# Altium project MB1292.PrjPcb (part 2 of 3)

## Sheet MEMS.SchDoc: MEMS sensors and Quad-SPI
size A4; Date: Not used; ApprovedBy: Not used; CheckedBy: Not used; Author: Not used; CompanyName: STMicroelectronics; DrawnBy: Not used; Engineer: Not used; Organization: Not used; Address1: Not used; Address2: Not used; Address3: Not used; Address4: Not used; DocumentNumber: Not used; Revision: Not used; SheetNumber: 4; SheetTotal: 8; CurrentTime: Not used; CurrentDate: Not used; Time: Not used; DocumentFullPathAndName: Not used; DocumentName: Not used; ModifiedDate: Not used; ImagePath: Not used; ProjectName: Not used; Application_BuildNumber: Not used
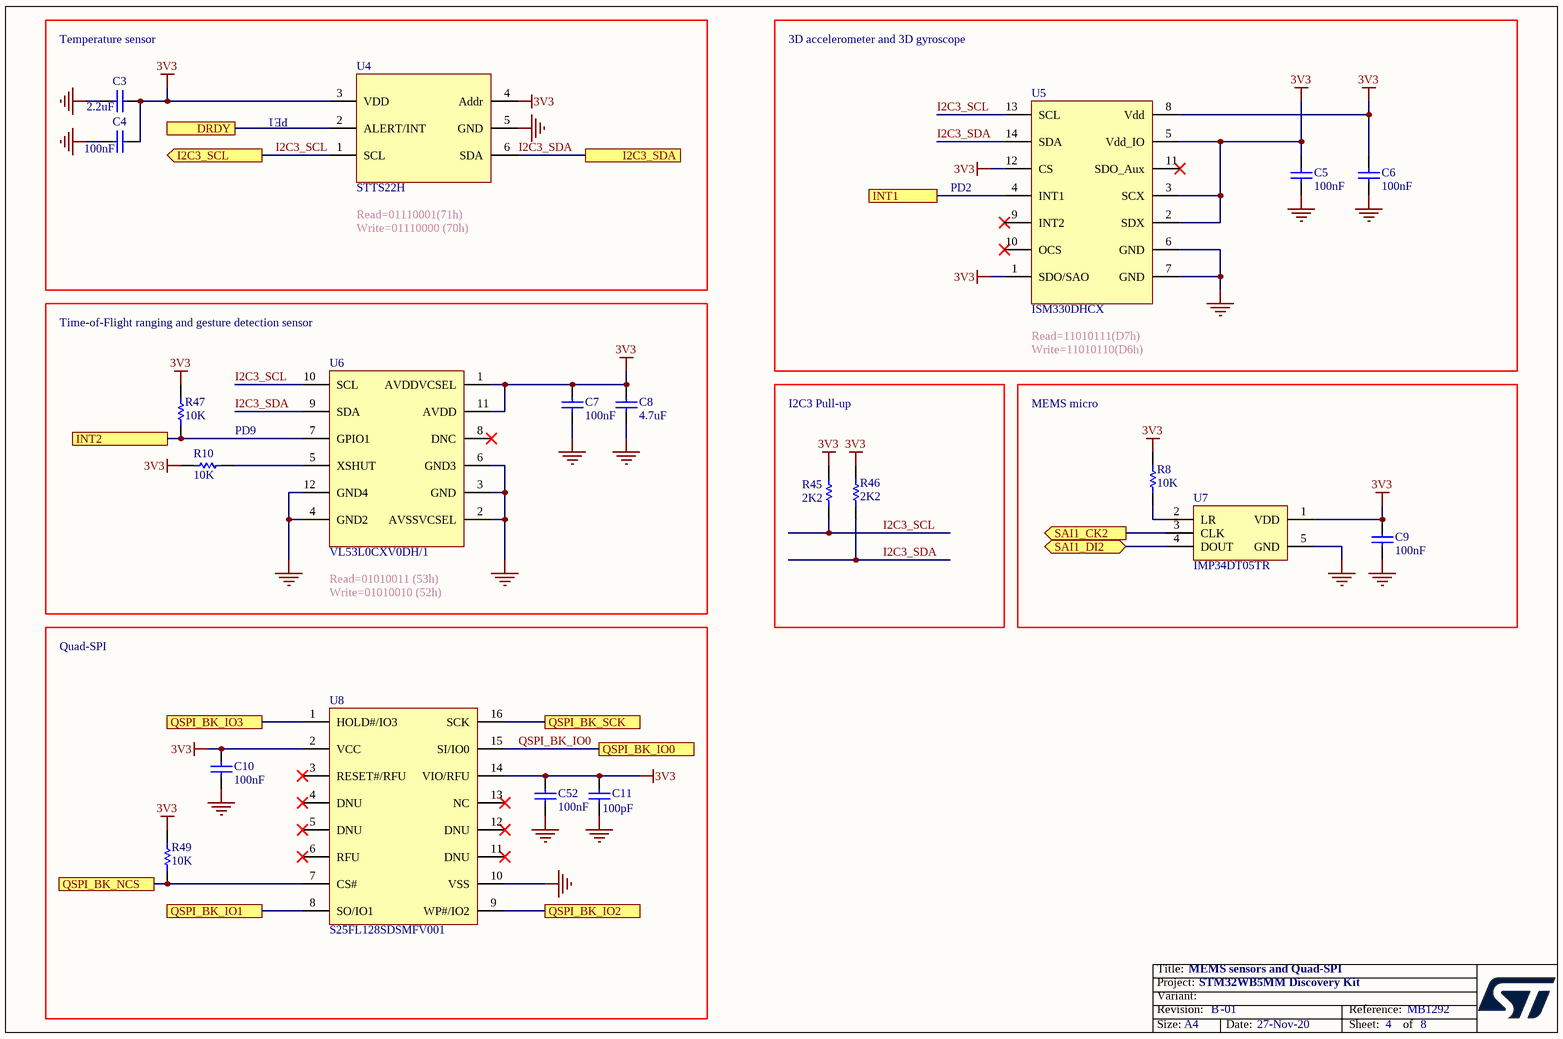
[diagram p4: MEMS.SchDoc]

### Parts
C3  value 2.2uF  [C0603_H0P8]  (hidden comment: Capacitor)
C4  value 100nF  [C0402]  (hidden comment: Capacitor)
C5  value 100nF  [C0402]  (hidden comment: Capacitor)
C6  value 100nF  [C0402]  (hidden comment: Capacitor)
C7  value 100nF  [C0402]  (hidden comment: Capacitor)
C8  value 4.7uF  [C0603]  (hidden comment: Capacitor)
C9  value 100nF  [C0402]  (hidden comment: Capacitor)
C10  value 100nF  [C0402]  (hidden comment: Capacitor)
C11  value 100pF  [C0603_H0P8]  (hidden comment: Capacitor)
C52  value 100nF  [C0402]  (hidden comment: Capacitor)
R8  value 10K  [R0402]  (hidden comment: Resistor)
R10  value 10K  [R0402]  (hidden comment: Resistor)
R45  value 2K2  [R0603]  (hidden comment: Resistor)
R46  value 2K2  [R0603]  (hidden comment: Resistor)
R47  value 10K  [R0402]  (hidden comment: Resistor)
R49  value 10K  [R0402]  (hidden comment: Resistor)
U4  STTS22H  [ICC_UDFN6-EPAD_2X2_P065]
U5  ISM330DHCX  [ICC_LGA14_3X2P5_P050]
U6  VL53L0CXV0DH/1  [OPT_TOF_ST_VL53L0X_LGA12_4P4X2P4_P080]
U7  IMP34DT05TR  [MIC_HCLGA_3X4X1_4LD]
U8  S25FL128SDSMFV001  [ICC_SOIC16_10P30X7P50_P127_H2P65]

### Blocks framed on the sheet
I2C3 Pull-up: R45 R46
MEMS micro: C9 R8 U7
Quad-SPI: C10 C11 C52 R49 U8

### Ports
DRDY, I2C3_SCL (out), I2C3_SDA, INT1, INT2, QSPI_BK_IO0, QSPI_BK_IO1, QSPI_BK_IO2, QSPI_BK_IO3, QSPI_BK_NCS, QSPI_BK_SCK, SAI1_CK2 (out), SAI1_DI2 (bidir)

### Nets
3V3: C3.2 C4.2 C5.2 C6.2 C7.2 C8.2 C9.2 C10.2 C11.2 C52.2 R8.2 R10.1 R45.2 R46.2 R47.2 R49.2 U4.3(VDD) U4.4(Addr) U5.1(SDO/SAO) U5.2(SDX) U5.3(SCX) U5.5(Vdd_IO) U5.8(Vdd) U5.12(CS) U6.1(AVDDVCSEL) U6.11(AVDD) U7.1(VDD) U8.2(VCC) U8.14(VIO/RFU)
GND: C3.1 C4.1 C5.1 C6.1 C7.1 C8.1 C9.1 C10.1 C11.1 C52.1 U4.5(GND) U5.6(GND) U5.7(GND) U6.2(AVSSVCSEL) U6.3(GND) U6.4(GND2) U6.6(GND3) U6.12(GND4) U7.5(GND) U8.10(VSS)
DRDY: U4.2(ALERT/INT) ; port DRDY
I2C3_SCL: R45.1 U4.1(SCL) U5.13(SCL) U6.10(SCL) ; port I2C3_SCL
I2C3_SDA: R46.1 U4.6(SDA) U5.14(SDA) U6.9(SDA) ; port I2C3_SDA
INT1: U5.4(INT1) ; port INT1
INT2: R47.1 U6.7(GPIO1) ; port INT2
QSPI_BK_IO0: U8.15(SI/IO0) ; port QSPI_BK_IO0
QSPI_BK_IO1: U8.8(SO/IO1) ; port QSPI_BK_IO1
QSPI_BK_IO2: U8.9(WP#/IO2) ; port QSPI_BK_IO2
QSPI_BK_IO3: U8.1(HOLD#/IO3) ; port QSPI_BK_IO3
QSPI_BK_NCS: R49.1 U8.7(CS#) ; port QSPI_BK_NCS
QSPI_BK_SCK: U8.16(SCK) ; port QSPI_BK_SCK
SAI1_CK2: U7.3(CLK) ; port SAI1_CK2
SAI1_DI2: U7.4(DOUT) ; port SAI1_DI2
NetR8_1: R8.1 U7.2(LR)
NetR10_2: R10.2 U6.5(XSHUT)

Not connected (* = marked no-connect by the designer): U5 9(INT2)* 10(OCS)* 11(SDO_Aux)*; U6 8(DNC)*; U8 3(RESET#/RFU)* 4(DNU)* 5(DNU)* 6(RFU)* 11(DNU)* 12(DNU)* 13(NC)*

### Notes on the sheet
- Temperature sensor
- 3D accelerometer and 3D gyroscope
- PE1
- Read=01110001(71h)
- Write=01110000 (70h)
- PD2
- Time-of-Flight ranging and gesture detection sensor
- Read=11010111(D7h)
- Write=11010110(D6h)
- (near R10) PD9
- Read=01010011 (53h)
- Write=01010010 (52h)
- Title:
- Project:
- Size:
- Revision:
- Variant:
- A4
- -
- Date:
- Reference:
- Sheet:
- of

### Library data of the parts
C3 = MCD-01540: Capacitor,MLCC, 2.2uF, 50V, X5R, +/-15%, 0603,T=0.8mm; Manufacturer_Part_Number: GRM188R61H225KE11; Manufacturer: MURATA; Part_Preference: Recommended; Order_Code_RS: 884-7289; Internal_Part_Number: MCD-01540; Status: Checked; Part_Type: Capacitor; Package: C0603; ComponentLink1URL: http://tunmcdsvn.tun.st.com/Component_Datasheet_Library/Trunk/Capacitors/Murata_Capacitor_GR_series/GRM188R61H225KE11#.pdf; Alternate_Manufacturer: N/A; Alternate_Manufacturer_Part_Number: N/A; Order_Code_Digikey: 490-10733-1-ND; Order_Code_Farnell: 2611925
C4-C7 C9 C10 C52 = MCD-00006: Capacitor, MLCC, 100nF, 16V, X7R, +/-10%, 0402, T=0.5mm; Manufacturer_Part_Number: CC0402KRX7R7BB104; Manufacturer: YAGEO; Alternate_Manufacturer_Part_Number: GCM155R71C104KA55D; Alternate_Manufacturer: MURATA; Part_Preference: Recommended; Order_Code_RS: 616-9701; Internal_Part_Number: MCD-00006; Status: Released; Part_Type: Capacitor; Package: C0402; ComponentLink1URL: http://tunmcdsvn.tun.st.com/Component_Datasheet_Library/Trunk/Capacitors/Yageo_Multilayer_Capacitor_X7R_series_100pF_to_22uF; Order_Code_Digikey: 311-1338-1-ND; Order_Code_Farnell: 9402047
C8 = MCD-00009: Capacitor, MLCC, 4.7uF, 16V, X5R, +/-10%, 0603, T=0.8mm; Manufacturer_Part_Number: CC0603KRX5R7BB475; Manufacturer: YAGEO; Part_Preference: Recommended; Internal_Part_Number: MCD-00009; Status: Released; Part_Type: Capacitor; Package: C0603; ComponentLink1URL: http://tunmcdsvn.tun.st.com/Component_Datasheet_Library/Trunk/Capacitors/Yageo_Multilayer_capacitor_X5R_series_100pF_to_100uF; Order_Code_Digikey: 311-1785-1-ND; Order_Code_Farnell: N/A; Order_Code_RS: N/A
C11 = MCD-01648: Capacitor,MLCC,100pF 50V,NPO,+/-5%, 0603,T=0,8mm; Manufacturer_Part_Number: CC0603JRNPO9BN101; Manufacturer: YAGEO; Part_Preference: Recommended; Order_Code_RS: 625-0267; Internal_Part_Number: MCD-01648; Status: Released; Part_Type: Capacitor; Package: C0603; ComponentLink1URL: http://tunmcdsvn.tun.st.com/Component_Datasheet_Library/Trunk/Capacitors/Yageo_UPY-GP_NP0_16V-to-50V/YAGEO_NP0_UPY-GP_NP0_16V-to-50V_16.pdf; Order_Code_Digikey: 311-1069-1-ND; Order_Code_Farnell: 722080
R8 R10 R47 R49 = MCD-00053: Resistor,10K,0402,1%,1/16W; Manufacturer_Part_Number: RC0402FR-0710KL; Manufacturer: YAGEO; BMS_Part_Number: 9131590; Part_Preference: Recommended; Internal_Part_Number: MCD-00053; Status: Released; Part_Type: Resistor; Package: R0402; ComponentLink1URL: http://tunmcdsvn.tun.st.com/Component_Datasheet_Library/Trunk/Resistors/Yageo_Resistor_RC0402-series; Order_Code_Digikey: 311-10.0KLRCT-ND; Order_Code_Farnell: 9239359; Order_Code_RS: N/A
R45 R46 = MCD-00349: Resistor,2K2,0603,1%,1/10W; Part_Preference: Recommended; Manufacturer: YAGEO; Manufacturer_Part_Number: RC0603FR-072K2L; Internal_Part_Number: MCD-00349; Status: Released; Part_Type: Resistor; Package: R0603; ComponentLink1URL: http://tunmcdsvn.tun.st.com/Component_Datasheet_Library/Trunk/Resistors/Yageo_Resistor_RC0603-series; Order_Code_Digikey: 311-2.20KHRCT-ND; Order_Code_Farnell: 9238522; Order_Code_RS: N/A
U4 = MCD-02159: temperature sensor; Part_Type: IC; Manufacturer: STMICROELECTRONICS; Part_Preference: Recommended; Manufacturer_HQ_COO: EU; Order_code_RS: 194-7646; Component_Country_Of_Origin: Thailand; Value: STTS22H; Order_code_Digikey: 497-STTS22HTR-ND; Order_code_Farnell: 3265386; Status: Checked; ComponentLink1URL: http://tunmcdsvn.tun.st.com/Component_Datasheet_Library/Trunk/IC/STM_MEMS_STTS22H; Internal_Part_Number: MCD-02159; Manufacturer_Part_Number: STTS22H; Alternate_Manufacturer_Part_Number: N/A; Alternate_Manufacturer: N/A; Package: UDFN 6-pins 2x2x0.5mm
U5 = MCD-02160: iNEMO inertial module: 3D accelerometer and 3D gyroscope, with digital output for industrial applications; Part_Type: IC; Manufacturer: STMICROELECTRONICS; Part_Preference: Recommended; Manufacturer_HQ_COO: EU; Order_code_RS: ISM330DHCXTR; Component_Country_Of_Origin: Malta, Philippines; Value: ISM330DHCX; Order_code_Digikey: 497-19784-2-ND; Order_code_Farnell: 3262493; Status: Checked; ComponentLink1URL: http://tunmcdsvn.tun.st.com/Component_Datasheet_Library/Trunk/IC/STM_3D-Gyro-ACC_ISM330DHCX; Internal_Part_Number: MCD-02160; Manufacturer_Part_Number: ISM330DHCXTR; Alternate_Manufacturer_Part_Number: N/A; Alternate_Manufacturer: N/A; Package: LGA-14L
U6 = MCD-01730: Time-of-Flight ranging and gesture detection; Part_Type: IC; Manufacturer: STMICROELECTRONICS; BMS_Part_Number: 9188012; Part_Preference: Recommended; Manufacturer_HQ_COO: EU; Component_Country_Of_Origin: China; Internal_Part_Number: MCD-01730; Value: VL53L0CXV0DH/1; Status: New; Manufacturer_Part_Number: VL53L0CXV0DH/1; Package: Optical LGA12 with liner; ComponentLink1URL: http://tunmcdsvn.tun.st.com/Component_Datasheet_Library/Trunk/IC/STM_sensor_VL53L0CXV0DH/vl53l0x.pdf
U7 = MCD-01715: MEMS audio sensor omnidirectional digital microphone for industrial applications; Part_Type: IC; Manufacturer: STMICROELECTRONICS; BMS_Part_Number: 9177995; Part_Preference: Recommended; Manufacturer_HQ_COO: EU; Component_Country_Of_Origin: Philippines; Internal_Part_Number: MCD-01715; Value: IMP34DT05TR; Status: Released; Manufacturer_Part_Number: IMP34DT05TR; Package: HCLGA-4LD; ComponentLink1URL: http://tunmcdsvn.tun.st.com/Component_Datasheet_Library/Trunk/IC/STM_Digital-Microphone_IMP34DT05TR
U8 = MCD-02038: Quad SPI with SOIC package 16-pins; Part_Type: IC; Manufacturer: CYPRESS; Part_Preference: Recommended; Value: S25FL128SDSMFV001; Order_Code_Digikey: S25FL128SDSMFV001-ND; Order_Code_Farnell: N/A; Order_Code_RS: N/A; Status: Released; ComponentLink1URL: http://tunmcdsvn.tun.st.com/Component_Datasheet_Library/Trunk/IC/Cypress_128_Mbit_3V_S25FL128SDSMFV001; Internal_Part_Number: MCD-02038; Manufacturer_Part_Number: S25FL128SDSMFV001; Alternate_Manufacturer_Part_Number: N/A; Alternate_Manufacturer: N/A; Package: SOIC 16-pins

## Sheet MCU_Display.SchDoc: Microcontroller and OLED display
size A4; Date: Not used; ApprovedBy: Not used; CheckedBy: Not used; Author: Not used; CompanyName: STMicroelectronics; DrawnBy: Not used; Engineer: Not used; Organization: Not used; Address1: Not used; Address2: Not used; Address3: Not used; Address4: Not used; DocumentNumber: Not used; Revision: Not used; SheetNumber: 3; SheetTotal: 8; CurrentTime: Not used; CurrentDate: Not used; Time: Not used; DocumentFullPathAndName: Not used; DocumentName: Not used; ModifiedDate: Not used; ImagePath: Not used; ProjectName: Not used; Application_BuildNumber: Not used
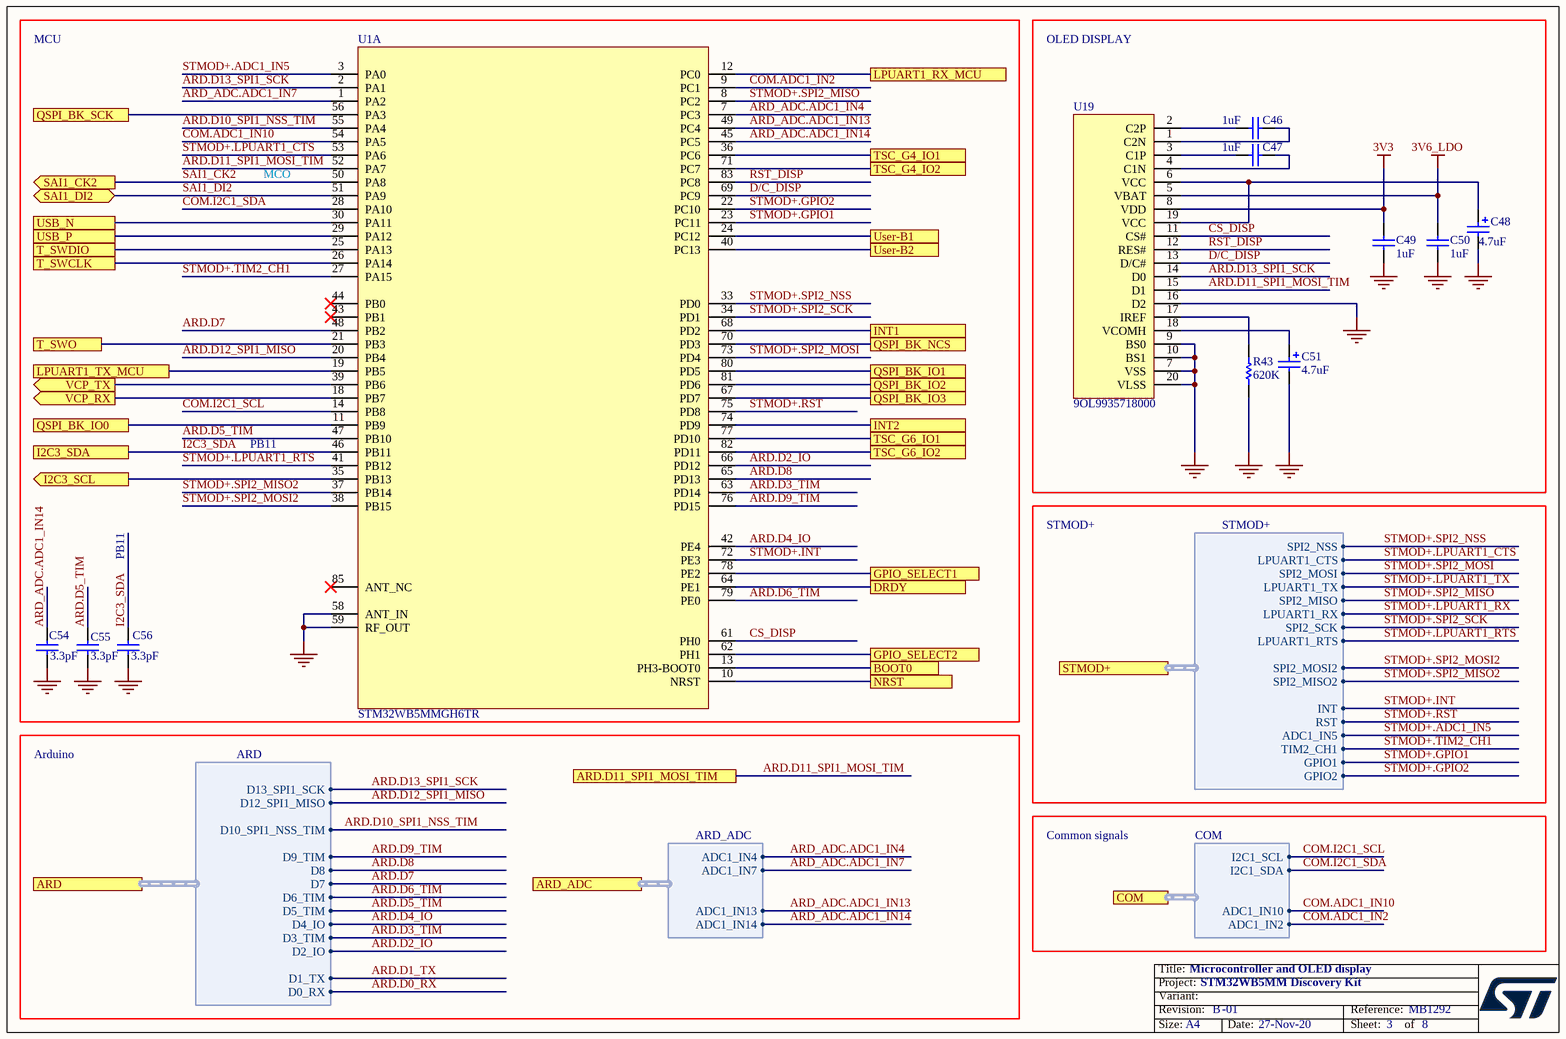
[diagram p5: MCU_Display.SchDoc]

### Parts
C46  value 1uF  [C0603]  (hidden comment: Capacitor)
C47  value 1uF  [C0603]  (hidden comment: Capacitor)
C48  value 4.7uF  [CPOL_TAJ-A_1206_H180]  (hidden comment: Cap_POL_TANA)
C49  value 1uF  [C0603]  (hidden comment: Capacitor)
C50  value 1uF  [C0603]  (hidden comment: Capacitor)
C51  value 4.7uF  [CPOL_TAJ-A_1206_H180]  (hidden comment: Cap_POL_TANA)
C54  value 3.3pF  [C0201_H0P3]  (hidden comment: Capacitor)
C55  value 3.3pF  [C0201_H0P3]  (hidden comment: Capacitor)
C56  value 3.3pF  [C0201_H0P3]  (hidden comment: Capacitor)
R43  value 620K  [R0603]  (hidden comment: Resistor)
U1  STM32WB5MMGH6TR  [MOD_DORY_STM_86P_7P3X11_H1P342]  (part A of 2)
U19  value 9OL9935718000  [OLED_RITDISPLAY_9OL9935718000]  (hidden comment: OLED_RITDISPLAY_9OL9935718000)

### Blocks framed on the sheet
OLED DISPLAY: C46-C51 R43 U19

### Ports
ARD (harness ARD), ARD.D11_SPI1_MOSI_TIM, ARD_ADC (harness ARD_ADC), BOOT0, COM (harness COM), DRDY, GPIO_SELECT1, GPIO_SELECT2, I2C3_SCL (out), I2C3_SDA, INT1, INT2, LPUART1_RX_MCU, LPUART1_TX_MCU, NRST, QSPI_BK_IO0, QSPI_BK_IO1, QSPI_BK_IO2, QSPI_BK_IO3, QSPI_BK_NCS, QSPI_BK_SCK, SAI1_CK2 (out), SAI1_DI2 (bidir), STMOD+ (harness STMOD+), T_SWCLK, T_SWDIO, T_SWO, TSC_G4_IO1, TSC_G4_IO2, TSC_G6_IO1, TSC_G6_IO2, USB_N, USB_P, User-B1, User-B2, VCP_RX (out), VCP_TX (out)

### Harnesses
STMOD+: SPI2_NSS, LPUART1_CTS, SPI2_MOSI, LPUART1_TX, SPI2_MISO, SPI2_SCK, LPUART1_RX, LPUART1_RTS, SPI2_MOSI2, SPI2_MISO2, INT, RST, ADC1_IN5, TIM2_CH1, GPIO1, GPIO2
ARD: D0_RX, D1_TX, D2_IO, D3_TIM, D4_IO, D5_TIM, D6_TIM, D7, D8, D9_TIM, D10_SPI1_NSS_TIM, D12_SPI1_MISO, D13_SPI1_SCK
ARD_ADC: ADC1_IN4, ADC1_IN7, ADC1_IN13, ADC1_IN14
COM: I2C1_SCL, I2C1_SDA, ADC1_IN10, ADC1_IN2

### Nets
3V3: C49.1 U19.8(VDD)
3V6_LDO: C50.1 U19.5(VBAT)
GND: C48.2 C49.2 C50.2 C51.2 C54.2 C55.1 C56.1 R43.1 U1.58(ANT_IN) U1.59(RF_OUT) U19.7(VSS) U19.9(BS0) U19.10(BS1) U19.16(D2) U19.20(VLSS)
ARD.D2_IO: U1.66(PD12) ; port ARD.D2_IO
ARD.D3_TIM: U1.63(PD14) ; port ARD.D3_TIM
ARD.D4_IO: U1.42(PE4) ; port ARD.D4_IO
ARD.D5_TIM: C55.2 U1.47(PB10) ; port ARD.D5_TIM
ARD.D6_TIM: U1.79(PE0) ; port ARD.D6_TIM
ARD.D7: U1.48(PB2) ; port ARD.D7
ARD.D8: U1.65(PD13) ; port ARD.D8
ARD.D9_TIM: U1.76(PD15) ; port ARD.D9_TIM
ARD.D10_SPI1_NSS_TIM: U1.55(PA4) ; port ARD.D10_SPI1_NSS_TIM
ARD.D11_SPI1_MOSI_TIM: U1.52(PA7) U19.15(D1) ; port ARD.D11_SPI1_MOSI_TIM
ARD.D12_SPI1_MISO: U1.20(PB4) ; port ARD.D12_SPI1_MISO
ARD.D13_SPI1_SCK: U1.2(PA1) U19.14(D0) ; port ARD.D13_SPI1_SCK
ARD_ADC.ADC1_IN4: U1.7(PC3) ; port ARD_ADC.ADC1_IN4
ARD_ADC.ADC1_IN7: U1.1(PA2) ; port ARD_ADC.ADC1_IN7
ARD_ADC.ADC1_IN13: U1.49(PC4) ; port ARD_ADC.ADC1_IN13
ARD_ADC.ADC1_IN14: C54.1 U1.45(PC5) ; port ARD_ADC.ADC1_IN14
BOOT0: U1.13(PH3-BOOT0) ; port BOOT0
COM.ADC1_IN2: U1.9(PC1) ; port COM.ADC1_IN2
COM.ADC1_IN10: U1.54(PA5) ; port COM.ADC1_IN10
COM.I2C1_SCL: U1.14(PB8) ; port COM.I2C1_SCL
COM.I2C1_SDA: U1.28(PA10) ; port COM.I2C1_SDA
CS_DISP: U1.61(PH0) U19.11(CS#)
D/C_DISP: U1.69(PC9) U19.13(D/C#)
DRDY: U1.64(PE1) ; port DRDY
GPIO_SELECT1: U1.78(PE2) ; port GPIO_SELECT1
GPIO_SELECT2: U1.62(PH1) ; port GPIO_SELECT2
I2C3_SCL: U1.35(PB13) ; port I2C3_SCL
I2C3_SDA: C56.2 U1.46(PB11) ; port I2C3_SDA
INT1: U1.68(PD2) ; port INT1
INT2: U1.74(PD9) ; port INT2
LPUART1_RX_MCU: U1.12(PC0) ; port LPUART1_RX_MCU
LPUART1_TX_MCU: U1.19(PB5) ; port LPUART1_TX_MCU
NRST: U1.10(NRST) ; port NRST
QSPI_BK_IO0: U1.11(PB9) ; port QSPI_BK_IO0
QSPI_BK_IO1: U1.80(PD5) ; port QSPI_BK_IO1
QSPI_BK_IO2: U1.81(PD6) ; port QSPI_BK_IO2
QSPI_BK_IO3: U1.67(PD7) ; port QSPI_BK_IO3
QSPI_BK_NCS: U1.70(PD3) ; port QSPI_BK_NCS
QSPI_BK_SCK: U1.56(PA3) ; port QSPI_BK_SCK
RST_DISP: U1.83(PC8) U19.12(RES#)
SAI1_CK2: U1.50(PA8) ; port SAI1_CK2
SAI1_DI2: U1.51(PA9) ; port SAI1_DI2
STMOD+.ADC1_IN5: U1.3(PA0) ; port STMOD+.ADC1_IN5
STMOD+.GPIO1: U1.23(PC11) ; port STMOD+.GPIO1
STMOD+.GPIO2: U1.22(PC10) ; port STMOD+.GPIO2
STMOD+.INT: U1.72(PE3) ; port STMOD+.INT
STMOD+.LPUART1_CTS: U1.53(PA6) ; port STMOD+.LPUART1_CTS
STMOD+.LPUART1_RTS: U1.41(PB12) ; port STMOD+.LPUART1_RTS
STMOD+.RST: U1.75(PD8) ; port STMOD+.RST
STMOD+.SPI2_MISO: U1.8(PC2) ; port STMOD+.SPI2_MISO
STMOD+.SPI2_MISO2: U1.37(PB14) ; port STMOD+.SPI2_MISO2
STMOD+.SPI2_MOSI: U1.73(PD4) ; port STMOD+.SPI2_MOSI
STMOD+.SPI2_MOSI2: U1.38(PB15) ; port STMOD+.SPI2_MOSI2
STMOD+.SPI2_NSS: U1.33(PD0) ; port STMOD+.SPI2_NSS
STMOD+.SPI2_SCK: U1.34(PD1) ; port STMOD+.SPI2_SCK
STMOD+.TIM2_CH1: U1.27(PA15) ; port STMOD+.TIM2_CH1
T_SWCLK: U1.26(PA14) ; port T_SWCLK
T_SWDIO: U1.25(PA13) ; port T_SWDIO
T_SWO: U1.21(PB3) ; port T_SWO
TSC_G4_IO1: U1.36(PC6) ; port TSC_G4_IO1
TSC_G4_IO2: U1.71(PC7) ; port TSC_G4_IO2
TSC_G6_IO1: U1.77(PD10) ; port TSC_G6_IO1
TSC_G6_IO2: U1.82(PD11) ; port TSC_G6_IO2
USB_N: U1.30(PA11) ; port USB_N
USB_P: U1.29(PA12) ; port USB_P
User-B1: U1.24(PC12) ; port User-B1
User-B2: U1.40(PC13) ; port User-B2
VCP_RX: U1.18(PB7) ; port VCP_RX
VCP_TX: U1.39(PB6) ; port VCP_TX
NetC46_1: C46.1 U19.2(C2P)
NetC46_2: C46.2 U19.1(C2N)
NetC47_1: C47.1 U19.3(C1P)
NetC47_2: C47.2 U19.4(C1N)
NetC48_1: C48.1 U19.6(VCC) U19.19(VCC)
NetC51_1: C51.1 U19.18(VCOMH)
NetR43_2: R43.2 U19.17(IREF)

Not connected (* = marked no-connect by the designer): U1 43(PB1)* 44(PB0)* 85(ANT_NC)*

### Notes on the sheet
- MCU
- MCO
- PB11
- STMOD+
- Arduino
- Common signals
- Title:
- Project:
- Size:
- Revision:
- Variant:
- A4
- -
- Date:
- Reference:
- Sheet:
- of

### Library data of the parts
C46 C47 C49 C50 = MCD-00010: Capacitor, MLCC, 1uF, 16V, X5R, +/-10%, 0603, T=0,8mm; Manufacturer_Part_Number: CC0603KRX5R7BB105; Manufacturer: YAGEO; Part_Preference: Recommended; Internal_Part_Number: MCD-00010; Status: Released; Part_Type: Capacitor; Package: C0603; ComponentLink1URL: http://tunmcdsvn.tun.st.com/Component_Datasheet_Library/Trunk/Capacitors/Yageo_Multilayer_capacitor_X5R_series_100pF_to_100uF; Order_Code_Digikey: 311-1444-1-ND; Order_Code_Farnell: 2370680; Order_Code_RS: N/A
C48 C51 = MCD-01043: Capacitor, Tantalum, 4.7uF, 25V, 5.5ohms, 10%,pkg Type_A (3216 metric), T=1.6mm; Manufacturer_Part_Number: 293D475X9025A2TE3; Manufacturer: VISHAY; Part_Preference: Recommended; Order_Code_RS: 179-7472; Revision: July-2002: Re-released for DXP Platform.; Internal_Part_Number: MCD-01043; Status: Checked; Part_Type: Capacitor; Package: Type_A; ComponentLink1URL: http://tunmcdsvn.tun.st.com/Component_Datasheet_Library/Trunk/Capacitors/VISHAY_CAPACITOR_TANTALUM_293D; Order_Code_Farnell: 2666694; Alternate_Manufacturer: N/A; Alternate_Manufacturer_Part_Number: N/A; Order_Code_Digikey: N/A
C54-C56 = MCD-02284: Capacitor, MLCC, 3.3pF, 50V, NPO, +-0.05pF, 0201, T=0.3mm".; Part_Preference: Recommended; Manufacturer: MURATA; Manufacturer_Part_Number: GRM0335C2A3R3WA01J; Internal_Part_Number: MCD-02284; Status: Checked; Part_Type: Capacitor; Alternate_Manufacturer: N/A; Alternate_Manufacturer_Part_Number: N/A; Package: C0201; ComponentLink1URL: http://tunmcdsvn.tun.st.com/Component_Datasheet_Library/Trunk/Capacitors/MURATA_Capacitor_GRM_series/MURATA_GRM_Datasheet.pdf; Order_Code_Digikey: N/A; Order_Code_Farnell: N/A; Order_Code_RS: N/A
R43 = MCD-00506: Resistor,620K,0603,1%,1/10W; Manufacturer_Part_Number: RC0603FR-07620KL; Manufacturer: YAGEO; Part_Preference: Recommended; Internal_Part_Number: MCD-00506; Status: Released; Part_Type: Resistor; Package: R0603; ComponentLink1URL: http://tunmcdsvn.tun.st.com/Component_Datasheet_Library/Trunk/Resistors/Yageo_Resistor_RC0603-series; Order_Code_Digikey: 311-620KHRCT-ND; Order_Code_Farnell: N/A; Order_Code_RS: N/A
U1 = MCD-01965: STM32 BLE module based on STM32WB55; Part_Type: Misc; Manufacturer: STMICROELECTRONICS; Part_Preference: Recommended; Manufacturer_HQ_COO: EU; Component_Country_Of_Origin: Taiwan; Value: STM32WB5MMGH6TR; Order_Code_Digikey: N/A; Order_Code_Farnell: N/A; Order_Code_RS: N/A; Status: Checked; ComponentLink1URL: http://tunmcdsvn.tun.st.com/Component_Datasheet_Library/Trunk/Misc/STM_STM32WBxxx_dory_module; Internal_Part_Number: MCD-01965; Manufacturer_Part_Number: STM32WB5MMGH6TR; Alternate_Manufacturer_Part_Number: N/A; Alternate_Manufacturer: N/A
U19 = MCD-01925: 128*64 Dots 20-pin OLED display; Alternate_Manufacturer_Part_Number: 9OL9935701000; Part_Preference: Recommended; Internal_Part_Number: MCD-01925; Status: Released; Part_Type: Display; Manufacturer_Part_Number: 9OL9935718000; Manufacturer: RITDISPLAY; Alternate_Manufacturer: RITDISPLAY; Package: SMT; ComponentLink1URL: http://tunmcdsvn.tun.st.com/Component_Datasheet_Library/Trunk/Display/RiTDisplay_128x64_OLED_white_9OL9935718000; Order_Code_Digikey: N/A; Order_Code_Farnell: N/A; Order_Code_RS: N/A

## Sheet Power_management.SchDoc: Power management
size A4; Date: Not used; ApprovedBy: Not used; CheckedBy: Not used; Author: Not used; CompanyName: STMicroelectronics; DrawnBy: Not used; Engineer: Not used; Organization: Not used; Address1: Not used; Address2: Not used; Address3: Not used; Address4: Not used; DocumentNumber: Not used; Revision: Not used; SheetNumber: 7; SheetTotal: 8; CurrentTime: Not used; CurrentDate: Not used; Time: Not used; DocumentFullPathAndName: Not used; DocumentName: Not used; ModifiedDate: Not used; ImagePath: Not used; ProjectName: Not used; Application_BuildNumber: Not used
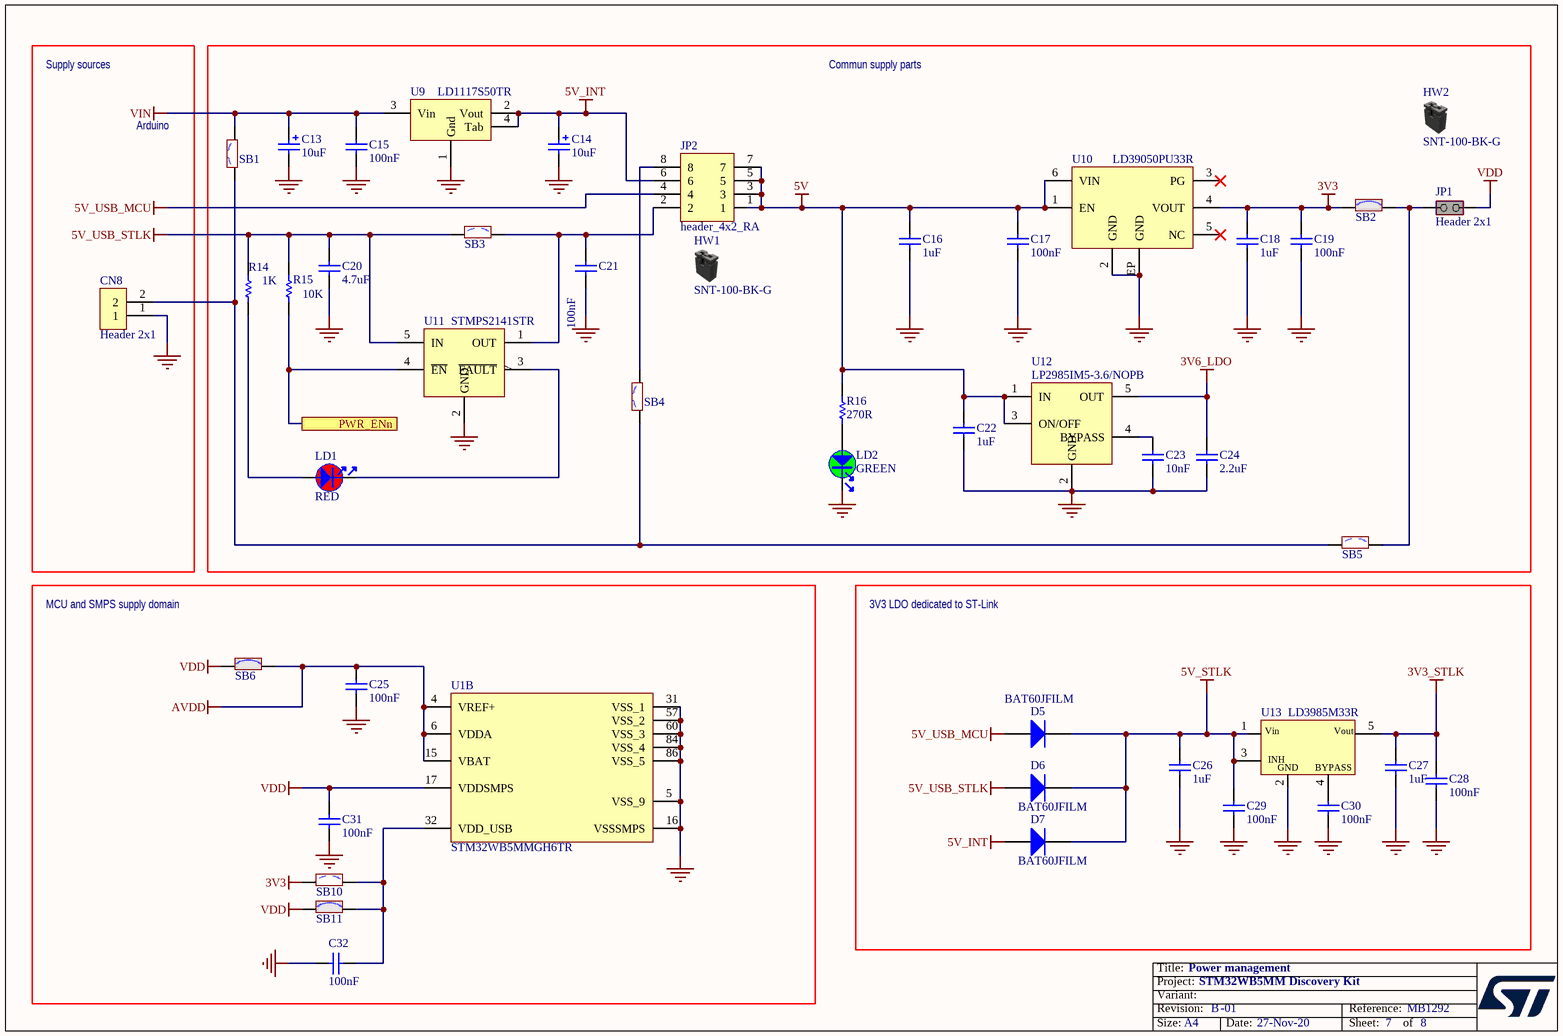
[diagram p6: Power_management.SchDoc]

### Parts
C13  value 10uF  [CPOL_TAJ-B_1210_H210]  (hidden comment: Cap_POL_TANA)
C14  value 10uF  [CPOL_TAJ-B_1210_H210]  (hidden comment: Cap_POL_TANA)
C15  value 100nF  [C0805_H0P85]  (hidden comment: Capacitor)
C16  value 1uF  [C0805_H0P85]  (hidden comment: Capacitor)
C17  value 100nF  [C0201_H0P3]  (hidden comment: Capacitor)
C18  value 1uF  [C0805_H0P85]  (hidden comment: Capacitor)
C19  value 100nF  [C0201_H0P3]  (hidden comment: Capacitor)
C20  value 4.7uF  [C0603_H0P8]  (hidden comment: Capacitor)
C21  value 100nF  [C0805_H0P85]  (hidden comment: Capacitor)
C22  value 1uF  [C0603]  (hidden comment: Capacitor)
C23  value 10nF  [C0603]  (hidden comment: Capacitor)
C24  value 2.2uF  [C0603]  (hidden comment: Capacitor)
C25  value 100nF  [C0201_H0P3]  (hidden comment: Capacitor)
C26  value 1uF  [C0402]  (hidden comment: Capacitor)
C27  value 1uF  [C0402]  (hidden comment: Capacitor)
C28  value 100nF  [C0201_H0P3]  (hidden comment: Capacitor)
C29  value 100nF  [C0201_H0P3]  (hidden comment: Capacitor)
C30  value 100nF  [C0201_H0P3]  (hidden comment: Capacitor)
C31  value 100nF  [C0201_H0P3]  (hidden comment: Capacitor)
C32  value 100nF  [C0201_H0P3]  (hidden comment: Capacitor)
CN8  Header 2x1  [CON_LYCONN_313102S141346]
D5  BAT60JFILM  [DIO_SOD323]
D6  BAT60JFILM  [DIO_SOD323]
D7  BAT60JFILM  [DIO_SOD323]
HW1  value SNT-100-BK-G  (hidden comment: Shunt Black 2.54mm)  (mechanical)
HW2  value SNT-100-BK-G  (hidden comment: Shunt Black 2.54mm)  (mechanical)
JP1  value Header 2x1  [CON_SAMTEC_TSW-102-07-G-S]  (hidden comment: Jumper_Header 2x1 Fitted)
JP2  value header_4x2_RA  [CON_SAMTEC_TSW-104-08-F-D-RA]  (hidden comment: Header 4x2)
LD1  value RED  [LED_0603_RED_H0P4]  (hidden comment: LED_red)
LD2  value GREEN  [LED_0603_OSRAM_LG-Q396-PS-35_GREEN_1A2K_H0P4]  (hidden comment: LED_green)
R14  value 1K  [R0603]  (hidden comment: Resistor)
R15  value 10K  [R0603]  (hidden comment: Resistor)
R16  value 270R  [R0603]  (hidden comment: Resistor)
SB1  SB_OFF  [SOLDER-BRIDGE_R0603-0R]  (value not drawn)
SB2  SB_ON  [SOLDER-BRIDGE_R0603-0R]  (value not drawn)
SB3  SB_OFF  [SOLDER-BRIDGE_R0603-0R]  (value not drawn)
SB4  SB_OFF  [SOLDER-BRIDGE_R0603-0R]  (value not drawn)
SB5  SB_OFF  [SOLDER-BRIDGE_R0603-0R]  (value not drawn)
SB6  SB_ON  [SOLDER-BRIDGE_R0603-0R]  (value not drawn)
SB10  SB_OFF  [SOLDER-BRIDGE_R0603-0R]  (value not drawn)
SB11  SB_ON  [SOLDER-BRIDGE_R0603-0R]  (value not drawn)
U1  STM32WB5MMGH6TR  [MOD_DORY_STM_86P_7P3X11_H1P342]  (part B of 2)
U9  LD1117S50TR  [REG_SOT223-TAB]
U10  LD39050PU33R  [ICC_DFN6-EPAD_3X3_P095]
U11  STMPS2141STR  [MOS_SOT23-5L]
U12  LP2985IM5-3.6/NOPB  [REG_SOT23-5L]
U13  LD3985M33R  [REG_SOT23-5L]

### Blocks framed on the sheet
Commun supply parts: C13-C24 HW1 HW2 JP1 JP2 LD1 LD2 R14-R16 SB1-SB5 U9-U12
MCU and SMPS supply domain: C25 C31 C32 SB6 SB10 SB11 U1
3V3 LDO dedicated to ST-Link: C26-C30 D5-D7 U13

### Ports
PWR_ENn

### Nets
3V3: C18.2 C19.2 SB2.1 SB10.1 U10.4(VOUT)
3V3_STLK: C27.2 C28.2 U13.5(Vout)
3V6_LDO: C24.2 U12.5(OUT)
5V: C16.2 C17.2 C22.1 JP2.1 JP2.3 JP2.5 JP2.7 R16.2 U10.1(EN) U10.6(VIN) U12.1(IN) U12.3(ON/OFF)
5V_INT: C14.1 D7.1(A) JP2.6 U9.2(Vout) U9.4(Tab)
5V_STLK: C26.2 C29.2 D5.2(K) D6.2(K) D7.2(K) U13.1(Vin) U13.3(CE)
5V_USB_MCU: D5.1(A) JP2.4
5V_USB_STLK: C20.2 D6.1(A) R14.2 R15.2 SB3.1 U11.5(IN)
AVDD: C25.2 SB6.2 U1.4(VREF+) U1.6(VDDA) U1.15(VBAT)
GND: C13.2 C14.2 C15.1 C16.1 C17.1 C18.1 C19.1 C20.1 C21.1 C22.2 C23.1 C24.1 C25.1 C26.1 C27.1 C28.1 C29.1 C30.1 C31.1 C32.2 CN8.1 LD2.2 U1.5(VSS_9) U1.16(VSSSMPS) U1.31(VSS_1) U1.57(VSS_2) U1.60(VSS_3) U1.84(VSS_4) U1.86(VSS_5) U9.1(Gnd) U10.2(GND) U10.EP(GND) U11.2(GND) U12.2(GND) U13.2(GND)
VDD: C31.2 JP1.2(NO) SB6.1 SB11.1 U1.17(VDDSMPS)
VIN: C13.1 C15.2 SB1.2 U9.3(Vin)
PWR_ENn: R15.1 U11.4(~{EN}) ; port PWR_ENn
NetC21_2: C21.2 JP2.2 SB3.2 U11.1(OUT)
NetC23_2: C23.2 U12.4(BYPASS)
NetC30_2: C30.2 U13.4(BYPASS)
NetC32_1: C32.1 SB10.2 SB11.2 U1.32(VDD_USB)
NetCN8_2: CN8.2 SB1.1 SB4.1 SB5.1
NetJP1_1: JP1.1(COMMON) SB2.2 SB5.2
NetJP2_8: JP2.8 SB4.2
NetLD1_1: LD1.1 R14.1
NetLD1_2: LD1.2 U11.3(~{FAULT})
NetLD2_1: LD2.1 R16.1

Not connected (* = marked no-connect by the designer): U10 3(PG)* 5(NC)*

### Notes on the sheet
- Supply sources
- Arduino
- Title:
- Project:
- Size:
- Revision:
- Variant:
- A4
- -
- Date:
- Reference:
- Sheet:
- of
- (in symbol MCD-00086) INH

### Library data of the parts
C13 C14 = MCD-00324: Capacitor, Tantalum, 10uF, 25V,2.5ohms, 10%, pkg Type_B (3528 metric), T=1.9mm; Manufacturer_Part_Number: TAJB106K025RNJ; Manufacturer: AVX; Part_Preference: Recommended; Order_Code_RS: 136-0159; Revision: July-2002: Re-released for DXP Platform.; Internal_Part_Number: MCD-00324; Status: Released; Part_Type: Capacitor; Package: Type_B; ComponentLink1URL: http://tunmcdsvn.tun.st.com/Component_Datasheet_Library/Trunk/Capacitors/AVX_Capacitor_TAJ-series; Order_Code_Digikey: 478-5257-1-ND; Order_Code_Farnell: 2333024
C15 C21 = MCD-01525: Capacitor, MLCC, 100nF, 50V, X7R, 10%, 0805, T=0,85mm; Manufacturer_Part_Number: CC0805KRX7R9BB104; Manufacturer: YAGEO; BMS_Part_Number: 9142249; Part_Preference: Recommended; Order_Code_RS: 669-8842; Internal_Part_Number: MCD-01525; Status: Released; Part_Type: Capacitor; Package: C0805; ComponentLink1URL: http://tunmcdsvn.tun.st.com/Component_Datasheet_Library/Trunk/Capacitors/Yageo_Multilayer_Capacitor_X7R_series_100pF_to_22uF/Yageo_Mutilayer_Capacitor_X7R_100pF_to_22uF.pdf; Order_Code_Digikey: 311-1140-1-ND; Order_Code_Farnell: 3019949
C16 C18 = MCD-01550: Capacitor, MLCC, 1uF, 16V, X5R, +/-10%, 0805, T=0.85mm; Manufacturer_Part_Number: CC0805KRX5R7BB105; Manufacturer: YAGEO; Part_Preference: Recommended; Internal_Part_Number: MCD-01550; Status: Released; Part_Type: Capacitor; Alternate_Manufacturer_Part_Number: N/A; Alternate_Manufacturer: N/A; Package: C0805; ComponentLink1URL: http://tunmcdsvn.tun.st.com/Component_Datasheet_Library/Trunk/Capacitors/Yageo_Multilayer_Capacitor_X7R_series_100pF_to_22uF/YAGEO_MLCC_UPY-GPHC_X7R_6.3V-to-50V_18.pdf; Order_Code_Digikey: 311-3427-1-ND; Order_Code_Farnell: N/A; Order_Code_RS: N/A
C17 C19 C25 C28-C32 = MCD-01535: Capacitor, MLCC,100nF, 10V, X7R, +/-10%, 0201, T=0.3mm; Manufacturer_Part_Number: GRM033R61A104KE15; Manufacturer: MURATA; Part_Preference: Recommended; Order_Code_RS: 790-2742; Internal_Part_Number: MCD-01535; Status: Checked; Part_Type: Capacitor; Package: C0201; ComponentLink1URL: http://tunmcdsvn.tun.st.com/Component_Datasheet_Library/Trunk/Capacitors/Murata_Capacitor_GR_series; Alternate_Manufacturer: N/A; Alternate_Manufacturer_Part_Number: N/A; Order_Code_Digikey: 490-5881-1-ND; Order_Code_Farnell: 2470450
C20 = MCD-01721: Capacitor, MLCC, 4.7uF, 10V, X5R, +/-10%, 0603, T=0.8mm; Manufacturer_Part_Number: CC0603KRX5R6BB475; Manufacturer: YAGEO; Part_Preference: Recommended; Internal_Part_Number: MCD-01721; Status: Released; Part_Type: Capacitor; Package: C0603; ComponentLink1URL: http://tunmcdsvn.tun.st.com/Component_Datasheet_Library/Trunk/Capacitors/Yageo_Multilayer_capacitor_X5R_series_100pF_to_100uF/YAGEO_MLCC_UPY-GPHC_X5R_4V-to-50V_25.pdf; Order_Code_Digikey: 311-1455-1-ND; Order_Code_Farnell: 1458898; Order_Code_RS: N/A
C22 = MCD-00010: as C46 on sheet MCU_Display; Internal_Part_Number: MCD-00010; Status: Released; Part_Type: Capacitor; Package: C0603; ComponentLink1URL: http://tunmcdsvn.tun.st.com/Component_Datasheet_Library/Trunk/Capacitors/Yageo_Multilayer_capacitor_X5R_series_100pF_to_100uF; Order_Code_Digikey: 311-1444-1-ND; Order_Code_Farnell: 2370680; Order_Code_RS: N/A
C23 = MCD-01007: Capacitor, MLCC, 10nF, 16V, X7R, +/-10%, 0603, T=0.8mm; Manufacturer_Part_Number: CC0603KRX7R7BB103; Manufacturer: YAGEO; Part_Preference: Recommended; Internal_Part_Number: MCD-01007; Status: Released; Part_Type: Capacitor; Package: C0603; ComponentLink1URL: http://tunmcdsvn.tun.st.com/Component_Datasheet_Library/Trunk/Capacitors/Yageo_Multilayer_Capacitor_X7R_series_100pF_to_22uF/; Order_Code_Digikey: 311-3369-1-ND; Order_Code_Farnell: N/A; Order_Code_RS: N/A
C24 = MCD-00012: Capacitor, MLCC, 2.2uF, 10V, X5R, +/- 10%, 0603, T=0,8mm; Manufacturer_Part_Number: CC0603KRX5R6BB225; Manufacturer: YAGEO; Alternate_Manufacturer_Part_Number: C0603C225K8PACTU; Alternate_Manufacturer: KEMET; BMS_Part_Number: 9142010; Part_Preference: Recommended; Internal_Part_Number: MCD-00012; Status: Released; Part_Type: Capacitor; Package: C0603; ComponentLink1URL: http://tunmcdsvn.tun.st.com/Component_Datasheet_Library/Trunk/Capacitors/Yageo_Multilayer_capacitor_X5R_series_100pF_to_100uF; Order_Code_Digikey: 311-1451-1-ND; Order_Code_Farnell: 2370679; Order_Code_RS: N/A
C26 C27 = MCD-01722: Capacitor, MLCC, 1uF, 10V, X5R, +/-10%, 0402, T=0.5mm; Manufacturer_Part_Number: CC0402KRX5R6BB105; Manufacturer: YAGEO; Part_Preference: Recommended; Internal_Part_Number: MCD-01722; Status: Released; Part_Type: Capacitor; Package: C0402; ComponentLink1URL: http://tunmcdsvn.tun.st.com/Component_Datasheet_Library/Trunk/Capacitors/Yageo_Multilayer_capacitor_X5R_series_100pF_to_100uF/Yageo_Multilayer_capacitor_X5R_100pF_to_100uF.pdf; Order_Code_Digikey: 311-1439-1-ND; Order_Code_Farnell: 1458896; Order_Code_RS: N/A
CN8 = MCD-01668: Header 2x1, 2.54mm, VR, TH, height 5.84mm/5.08 mm, height total 13.46 mm; Part_Type: Connector; Manufacturer_Part_Number: 313102S141346; Manufacturer: LYCONN; Part_Preference: Recommended; Internal_Part_Number: MCD-01668; Value: Header 2x1; Status: Released; ComponentLink1URL: http://tunmcdsvn.tun.st.com/Component_Datasheet_Library/Trunk/Connectors/LYCONN_31XXX_2.54mm_L13.46mm/LYCONN_31XXX_2.54mm_L13.46mm.pdf
D5-D7 = MCD-00034: Manufacturer: STMICROELECTRONICS; Part_Type: Diode; BMS_Part_Number: 9151097; Part_Preference: Recommended; Manufacturer_HQ_COO: EU; Internal_Part_Number: MCD-00034; Value: BAT60JFILM; Manufacturer_Part_Number: BAT60JFILM; Status: Released; ComponentLink1URL: http://tunmcdsvn.tun.st.com/Component_Datasheet_Library/Trunk/Diodes/STM_Diode_BAT60JFILM-SOD323
HW1 HW2 = MCD-00043: SHUNT 2.54mm BLACK; Part_Type: Misc; Manufacturer: SAMTEC; Alternate_Manufacturer_Part_Number: 316102S111A; Alternate_Manufacturer: JIUBABA; Part_Preference: Recommended; Internal_Part_Number: MCD-00043; Status: Released; Manufacturer_Part_Number: SNT-100-BK-G; ComponentLink1URL: http://tunmcdsvn.tun.st.com/Component_Datasheet_Library/Trunk/Connectors/Samtec_Shunt_Jumper_SNT100
JP1 = MCD-01904: Header, 2x1, 2,54mm, VR, TH, Height 5.84mm/2.54mm - Shunt Fitted by default; Part_Type: Connector; Manufacturer_Part_Number: TSW-102-07-G-S; Manufacturer: SAMTEC; Part_Preference: Recommended; Order_Code_RS: 155-7981; Internal_Part_Number: MCD-01904; Status: Checked; ComponentLink1URL: http://tunmcdsvn.tun.st.com/Component_Datasheet_Library/Trunk/Connectors/Samtec_TSW-HTSW-series; Alternate_Manufacturer: N/A; Alternate_Manufacturer_Part_Number: N/A; Order_Code_Digikey: SAM1029-02-ND; Order_Code_Farnell: 2505044
JP2 = MCD-02037: Header, 4x2, 2,29mm, RA, TH, height 5,84mm; Part_Type: Connector; Manufacturer_Part_Number: TSW-104-08-F-D-RA; Manufacturer: SAMTEC; Part_Preference: Recommended; Internal_Part_Number: MCD-02037; Status: Released; ComponentLink1URL: http://tunmcdsvn.tun.st.com/Component_Datasheet_Library/Trunk/Connectors/Samtec_TSW-HTSW-series/; Order_Code_Digikey: SAM13034-ND; Order_Code_Farnell: 2032652; Order_Code_RS: N/A; Alternate_Manufacturer_Part_Number: N/A; Alternate_Manufacturer: N/A
LD1 = MCD-00322: LED, Red, 0603; Part_Type: Display; Manufacturer_Part_Number: 19-217/R6C-AL1M2VY/3T; Manufacturer: EVERLIGHT; Part_Preference: Recommended; Internal_Part_Number: MCD-00322; Status: Released; Package: LED 0603; ComponentLink1URL: http://tunmcdsvn.tun.st.com/Component_Datasheet_Library/Trunk/Display/Everlight_SMD-LED-RED_19-213-R6C-AP1Q2B-3T-V3.doc
LD2 = MCD-00588: LED Green, 0603 SMD, Forward Voltage Typ=2V, Max=2.5V; Part_Type: Display; Manufacturer_Part_Number: LG Q396-PS-35; Manufacturer: OSRAM OPTO SEMICONDUCTORS; Alternate_Manufacturer_Part_Number: VLMTG1300-GS08; Alternate_Manufacturer: VISHAY SEMICONDUCTOR OPTO DIVISION; Part_Preference: Recommended; Internal_Part_Number: MCD-00588; Status: Released; Package: LED 0603; ComponentLink1URL: http://tunmcdsvn.tun.st.com/Component_Datasheet_Library/Trunk/Display/OSRAM_LED_GREEN_LG Q396-PS-35; Order_Code_Digikey: LG Q396-PS-35-ND
R14 = MCD-00070: Resistor,1K,0603,1%,1/10W; Manufacturer_Part_Number: RC0603FR-071KL; Manufacturer: YAGEO; Part_Preference: Recommended; Internal_Part_Number: MCD-00070; Status: Released; Part_Type: Resistor; Package: R0603; ComponentLink1URL: http://tunmcdsvn.tun.st.com/Component_Datasheet_Library/Trunk/Resistors/Yageo_Resistor_RC0603-series; Order_Code_Digikey: 311-1.00KHRCT-ND; Order_Code_Farnell: 9238484RL; Order_Code_RS: N/A
R15 = MCD-00220: Resistor,10K,0603,1%,1/10W; Manufacturer_Part_Number: RC0603FR-0710KL; Manufacturer: YAGEO; Part_Preference: Recommended; Internal_Part_Number: MCD-00220; Status: Released; Part_Type: Resistor; Package: R0603; ComponentLink1URL: http://tunmcdsvn.tun.st.com/Component_Datasheet_Library/Trunk/Resistors/Yageo_Resistor_RC0603-series; Order_Code_Digikey: 311-10.0KHRCT-ND; Order_Code_Farnell: 9238603; Order_Code_RS: N/A
R16 = MCD-00442: Resistor,270R,0603,1%,1/10W; Manufacturer_Part_Number: RC0603FR-07270RL; Manufacturer: YAGEO; Part_Preference: Recommended; Internal_Part_Number: MCD-00442; Status: Released; Part_Type: Resistor; Package: R0603; ComponentLink1URL: http://tunmcdsvn.tun.st.com/Component_Datasheet_Library/Trunk/Resistors/Yageo_Resistor_RC0603-series; Order_Code_Digikey: 311-270HRCT-ND; Order_Code_Farnell: 9238417; Order_Code_RS: N/A
SB1 SB3-SB5 SB10 = MCD-00072: Solder Bridge OFF; Part_Type: Misc; Manufacturer_Part_Number: RC0603JR-070RL; Manufacturer: YAGEO; Part_Preference: Recommended; Internal_Part_Number: MCD-00072; Status: Released; Package: SB0603; ComponentLink1URL: http://tunmcdsvn.tun.st.com/Component_Datasheet_Library/Trunk/Resistors/Yageo_Resistor_RC0603-series
SB2 SB6 SB11 = MCD-00071: Solder Bridge ON; Part_Type: Misc; Manufacturer_Part_Number: RC0603JR-070RL; Manufacturer: YAGEO; Part_Preference: Recommended; Internal_Part_Number: MCD-00071; Status: Released; Package: SB0603; ComponentLink1URL: http://tunmcdsvn.tun.st.com/Component_Datasheet_Library/Trunk/Resistors/Yageo_Resistor_RC0603-series
U1 = MCD-01965: as U1 on sheet MCU_Display; Value: STM32WB5MMGH6TR; Order_Code_Digikey: N/A; Order_Code_Farnell: N/A; Order_Code_RS: N/A; Status: Checked; ComponentLink1URL: http://tunmcdsvn.tun.st.com/Component_Datasheet_Library/Trunk/Misc/STM_STM32WBxxx_dory_module; Internal_Part_Number: MCD-01965; Manufacturer_Part_Number: STM32WB5MMGH6TR; Alternate_Manufacturer_Part_Number: N/A; Alternate_Manufacturer: N/A
U9 = MCD-00088: IC REG LDO 5V 0.8A SOT223; Manufacturer: STMICROELECTRONICS; BMS_Part_Number: 9176133; Part_Preference: Recommended; Manufacturer_HQ_COO: EU; Internal_Part_Number: MCD-00088; Value: LD1117S50TR; Status: Released; Part_Type: IC; Manufacturer_Part_Number: LD1117S50TR; Package: SOT-223; ComponentLink1URL: http://tunmcdsvn.tun.st.com/Component_Datasheet_Library/Trunk/IC/STM_LDO_LD1117
U10 = MCD-00215: Low quiescent current and low noise voltage regulators; Part_Type: IC; Manufacturer: STMICROELECTRONICS; BMS_Part_Number: 9176126; Part_Preference: Recommended; Manufacturer_HQ_COO: EU; Internal_Part_Number: MCD-00215; Value: LD39050PU33R; Status: Released; Manufacturer_Part_Number: LD39050PU33R; Package: DFN6 3x3mm; ComponentLink1URL: http://tunmcdsvn.tun.st.com/Component_Datasheet_Library/Trunk/IC/STM_LDO_LD39050PU
U11 = MCD-00083: Enhanced single channel power switches with active low enable pin; Part_Type: IC; Manufacturer: STMICROELECTRONICS; Alternate_Manufacturer_Part_Number: TPS2041C; Alternate_Manufacturer: TEXAS INSTRUMENTS; BMS_Part_Number: 9159003; Part_Preference: Recommended; Manufacturer_HQ_COO: EU; Internal_Part_Number: MCD-00083; Value: STMPS2141STR; Status: Released; Manufacturer_Part_Number: STMPS2141STR; ComponentLink1URL: http://tunmcdsvn.tun.st.com/Component_Datasheet_Library/Trunk/IC/STM_PWR-Switch_STMPS2141STR
U12 = MCD-01030: LDO VOLTAGE REGULATOR, 3.6V, 150mA, 5-SOT-23, FULL REEL; Part_Type: IC; Manufacturer: TEXAS INSTRUMENTS; Part_Preference: Recommended; Order_Code_RS: 651-9948; Internal_Part_Number: MCD-01030; Value: LP2985IM5-3.6/NOPB; Status: Checked; Manufacturer_Part_Number: LP2985IM5-3.6/NOPB; Package: REG_SOT23-5L; ComponentLink1URL: http://tunmcdsvn.tun.st.com/Component_Datasheet_Library/Trunk/IC/TI_LDO_LP2985IM5-3.6; Alternate_Manufacturer: N/A; Alternate_Manufacturer_Part_Number: N/A; Order_Code_Digikey: LP2985IM5-3.6/NOPBCT-ND; Order_Code_Farnell: 3007634
U13 = MCD-00086: Ultra low drop-low noise BiCMOS voltage, regulators low ESR capacitors compatible; Part_Type: IC; Manufacturer: STMICROELECTRONICS; BMS_Part_Number: 9176161; Part_Preference: Recommended; Manufacturer_HQ_COO: EU; Internal_Part_Number: MCD-00086; Value: LD3985M33R; Status: Released; Manufacturer_Part_Number: LD3985M33R; ComponentLink1URL: http://tunmcdsvn.tun.st.com/Component_Datasheet_Library/Trunk/IC/STM_LDO_LD3985